# Altium project ImprovedBlackPillF411.PrjPcb
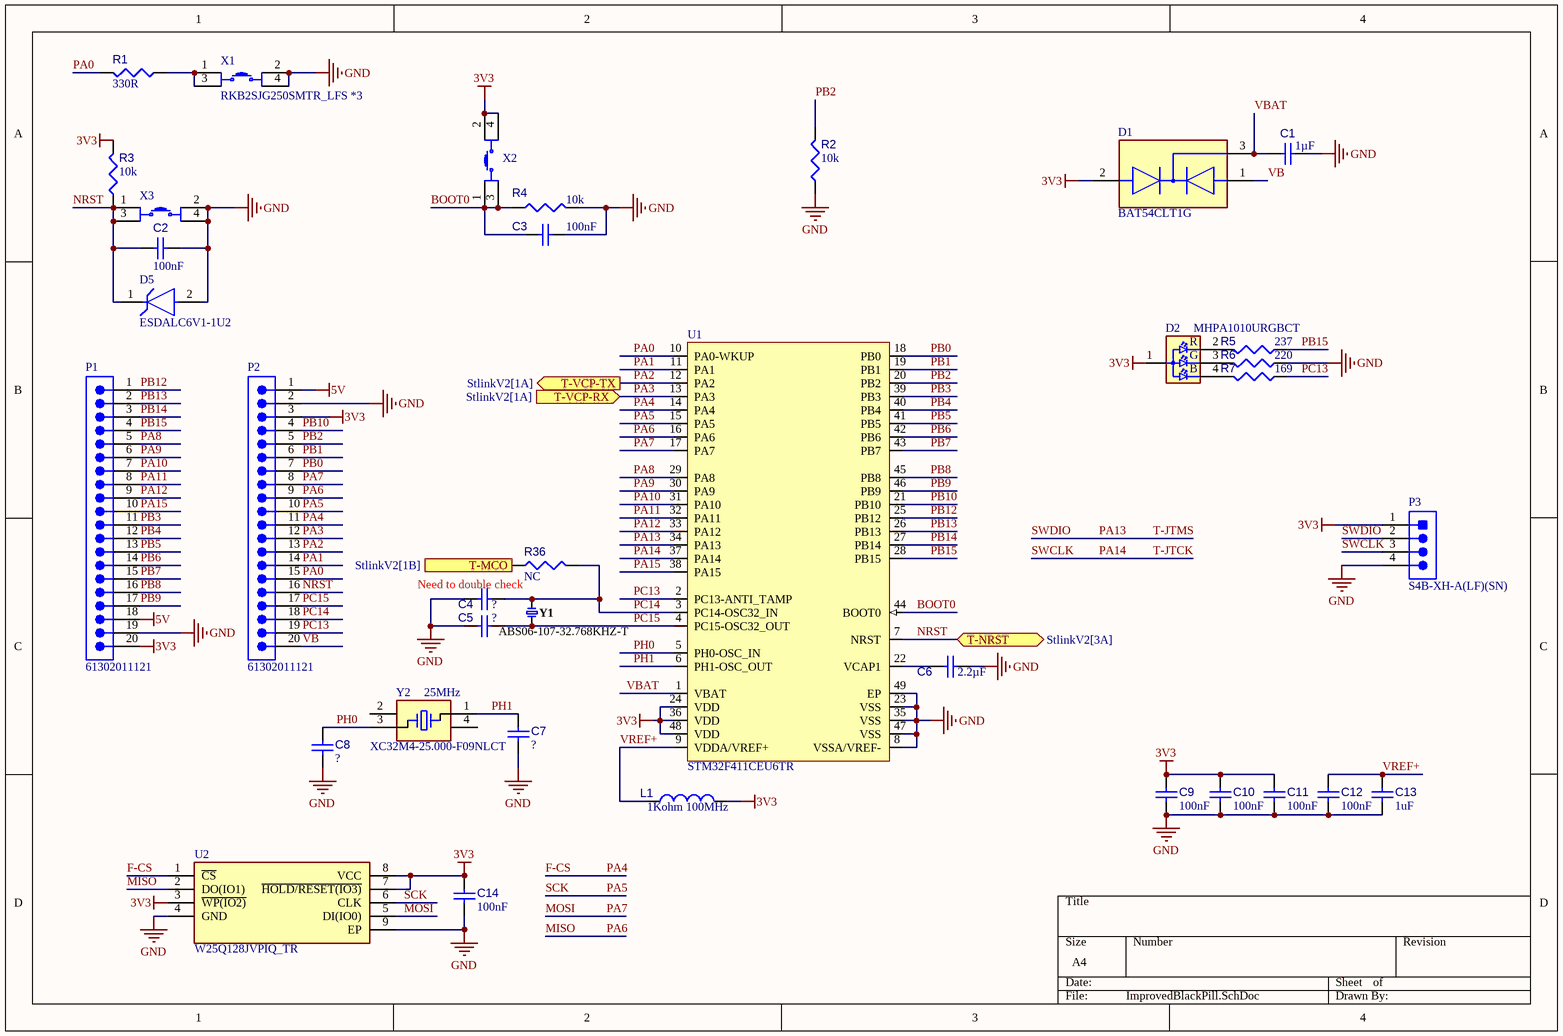
[diagram p0: ImprovedBlackPill.SchDoc]
3 sheets, 107 parts. Net scope: flat (ports and power ports of the same name join across sheets).
Sheets:
  ImprovedBlackPill.SchDoc
  StlinkV2.SchDoc
  Power.SchDoc

## Sheet ImprovedBlackPill.SchDoc
size A4; SheetNumber: 1; SheetTotal: 3

### Parts
C1  value 1µF  [CAPC1005X55X25ML05T10]  (hidden comment: Capacitor 1 uF +/- 10% 6.3 V 0402)
C2  value 100nF  [CAPC1005X55X25ML05T05]  (hidden comment: Capacitor 10 pF +/- 5% 50 V 0402)
C3  value 100nF  [CAPC1005X55X25ML05T05]  (hidden comment: Capacitor 10 pF +/- 5% 50 V 0402)
C4  Capacitor 10 pF +/- 5% 50 V 0402  [CAPC1005X55X25ML05T05]  (value not drawn)
C5  Capacitor 10 pF +/- 5% 50 V 0402  [CAPC1005X55X25ML05T05]  (value not drawn)
C6  value 2.2µF  [CAPC2013X135X45NL10T25]  (hidden comment: Capacitor 1 uF +/- 10% 50 V 0805)
C7  Capacitor 10 pF +/- 5% 50 V 0402  [CAPC1005X55X25ML05T05]  (value not drawn)
C8  Capacitor 10 pF +/- 5% 50 V 0402  [CAPC1005X55X25ML05T05]  (value not drawn)
C9  value 100nF  [CAPC1005X55X25ML05T05]  (hidden comment: Capacitor 10 pF +/- 5% 50 V 0402)
C10  value 100nF  [CAPC1005X55X25ML05T05]  (hidden comment: Capacitor 10 pF +/- 5% 50 V 0402)
C11  value 100nF  [CAPC1005X55X25ML05T05]  (hidden comment: Capacitor 10 pF +/- 5% 50 V 0402)
C12  value 100nF  [CAPC1005X55X25ML05T05]  (hidden comment: Capacitor 10 pF +/- 5% 50 V 0402)
C13  value 1uF  [CAPC1005X55X25ML05T05]  (hidden comment: Capacitor 10 pF +/- 5% 50 V 0402)
C14  value 100nF  [CAPC1005X55X25ML05T05]  (hidden comment: Capacitor 10 pF +/- 5% 50 V 0402)
D1  BAT54CLT1G  [FP-318-08-IPC_C]
D2  MHPA1010URGBCT  [FP-SML-LX0404SIUPGUSB-MFG]
D5  ESDALC6V1-1U2  [FP-ST0201-MFG]
L1  value 1Kohm 100MHz  [MURA-LQP15MN3N6B02D-2_N]  (hidden comment: LQP15MN3N6B02D)
P1  61302011121  [61302011121]
P2  61302011121  [61302011121]
P3  S4B-XH-A(LF)(SN)  [JST-S4B-XH-A(LF)(SN)_V]
R1  value 330R  [RESC1005X40X25ML10T10]  (hidden comment: Resistor 15k +/-1% 0402 63 mW)
R2  value 10k  [RESC1005X40X25ML10T10]  (hidden comment: Resistor 15k +/-1% 0402 63 mW)
R3  value 10k  [RESC1005X40X25ML10T10]  (hidden comment: Resistor 15k +/-1% 0402 63 mW)
R4  value 10k  [RESC1005X40X25ML10T10]  (hidden comment: Resistor 15k +/-1% 0402 63 mW)
R5  value 237  [RESC1005X40X25ML10T10]  (hidden comment: Resistor 15k +/-1% 0402 63 mW)
R6  value 220  [RESC1005X40X25ML10T10]  (hidden comment: Resistor 15k +/-1% 0402 63 mW)
R7  value 169  [RESC1005X40X25ML10T10]  (hidden comment: Resistor 15k +/-1% 0402 63 mW)
R36  value NC  [RESC0402(1005)_L]  (hidden comment: Jumper 0402)
U1  STM32F411CEU6TR  [STM-UFQFPN48_N]
U2  W25Q128JVPIQ_TR  [SON127P600X500X80-9N-D]
X1  RKB2SJG250SMTR_LFS *3  [RKB2SJG250SMTRLFS]
X2  RKB2SJG250SMTR_LFS  [RKB2SJG250SMTRLFS]  (value not drawn)
X3  RKB2SJG250SMTR_LFS  [RKB2SJG250SMTRLFS]  (value not drawn)
Y1  ABS06-107-32.768KHZ-T  [FP-ABS06-MFG]
Y2  XC32M4-25.000-F09NLCT  [830105863709]

### Ports
T-MCO (out, see StlinkV2[1B]), T-NRST (bidir, see StlinkV2[3A]), T-VCP-RX (in, see StlinkV2[1A]), T-VCP-TX (out, see StlinkV2[1A])

### Nets
3V3: C9.2 C10.2 C11.2 C14.2 D1.2(2_ANODE) D2.1(Common_Anode) L1.1 P1.20 P2.3 P3.1 R3.2 U1.24(VDD) U1.36(VDD) U1.48(VDD) U2.3(~{WP}~{(IO2)}) U2.7(~{HOLD/RESET(IO3)}) U2.8(VCC) X2.2(COM_2) X2.4(NO_2)
5V: P1.18 P2.1
GND: C1.2 C2.2 C3.2 C4.1 C5.1 C6.2 C7.1 C8.1 C9.1 C10.1 C11.1 C12.1 C13.1 C14.1 D5.2(A) P1.19 P2.2 P3.4 R2.1 R4.2 R6.1 U1.8(VSSA/VREF-) U1.23(VSS) U1.35(VSS) U1.47(VSS) U1.49(EP) U2.4(GND) U2.9(EP) X1.2(COM_2) X1.4(NO_2) X3.2(COM_2) X3.4(NO_2)
BOOT0: C3.1 R4.1 U1.44(BOOT0) X2.1(COM_1) X2.3(NO_1)
F-CS: P2.11 U1.14(PA4) U2.1(~{CS})  [also labelled PA4]
MISO: P2.9 U1.16(PA6) U2.2(DO(IO1))  [also labelled PA6]
MOSI: P2.8 U1.17(PA7) U2.5(DI(IO0))  [also labelled PA7]
NRST: C2.1 D5.1(C) P2.16 R3.1 U1.7(NRST) X3.1(COM_1) X3.3(NO_1) ; port T-NRST
PA0: P2.15 R1.2 U1.10(PA0-WKUP)
PA1: P2.14 U1.11(PA1)
PA2: P2.13 U1.12(PA2) ; port T-VCP-TX
PA3: P2.12 U1.13(PA3) ; port T-VCP-RX
PA5: P2.10 U1.15(PA5) U2.6(CLK)  [also labelled SCK]
PA8: P1.5 U1.29(PA8)
PA9: P1.6 U1.30(PA9)
PA10: P1.7 U1.31(PA10)
PA11: P1.8 U1.32(PA11)
PA12: P1.9 U1.33(PA12)
PA13: P3.2 U1.34(PA13)  [also labelled SWDIO, T-JTMS]
PA14: P3.3 U1.37(PA14)  [also labelled SWCLK, T-JTCK]
PA15: P1.10 U1.38(PA15)
PB0: P2.7 U1.18(PB0)
PB1: P2.6 U1.19(PB1)
PB2: P2.5 R2.2 U1.20(PB2)
PB3: P1.11 U1.39(PB3)
PB4: P1.12 U1.40(PB4)
PB5: P1.13 U1.41(PB5)
PB6: P1.14 U1.42(PB6)
PB7: P1.15 U1.43(PB7)
PB8: P1.16 U1.45(PB8)
PB9: P1.17 U1.46(PB9)
PB10: P2.4 U1.21(PB10)
PB12: P1.1 U1.25(PB12)
PB13: P1.2 U1.26(PB13)
PB14: P1.3 U1.27(PB14)
PB15: P1.4 R5.1 U1.28(PB15)
PC13: P2.19 R7.1 U1.2(PC13-ANTI_TAMP)
PC14: C4.2 P2.18 R36.2 U1.3(PC14-OSC32_IN) Y1.2
PC15: C5.2 P2.17 U1.4(PC15-OSC32_OUT) Y1.1
PH0: C8.2 U1.5(PH0-OSC_IN) Y2.3(CRYSTAL__2)
PH1: C7.2 U1.6(PH1-OSC_OUT) Y2.1(CRYSTAL__1)
VB: D1.1(1_ANODE) P2.20
VBAT: C1.1 D1.3(C) U1.1(VBAT)
VREF+: C12.2 C13.2 L1.2 U1.9(VDDA/VREF+)
NetC6_1: C6.1 U1.22(VCAP1)
NetD2_2: D2.2(Red_C) R5.2
NetD2_3: D2.3(Blue_C) R6.2
NetD2_4: D2.4(B) R7.2
NetR1_1: R1.1 X1.1(COM_1) X1.3(NO_1)
NetR11_2: R36.1 ; port T-MCO

Not connected (* = marked no-connect by the designer): Y2 2(GND_&_LID_1) 4(GND_&_LID_2)

### Notes on the sheet
- Need to double check
- (near Y2) 25MHz
- (in symbol CMP-007-00037-2) R; G

### Library data of the parts
C1 = CMP-001-00008-7: Chip Capacitor, 1 uF, +/- 10%, 6.3 V, 0402 (1005 Metric); Capacitor Type: Ceramic; Voltage Rating: 6.3V; Max Operating Temperature: 85°C; Mounting Technology: SM; Tolerance: 10%; Case/Package: 0402; RoHS Compliant: True; Min Operating Temperature: -55°C; Pins: 2
C2 C4 C5 C9 = CMP-001-00013-7: Chip Capacitor, 10 pF, +/- 5%, 50 V, 0402 (1005 Metric); Capacitor Type: Ceramic; Voltage Rating: 50V; Max Operating Temperature: 125°C; Pins: 2; Mounting Technology: SM; Tolerance: 5%; RoHS Compliant: True; Case/Package: 0402; Min Operating Temperature: -55°C
  C4 C5: Value: ?
C3 C7 C8 C10-C14 = CMP-001-00013-6: Chip Capacitor, 10 pF, +/- 5%, 50 V, 0402 (1005 Metric); Capacitor Type: Ceramic; Voltage Rating: 50V; Max Operating Temperature: 125°C; Pins: 2; Mounting Technology: SM; Tolerance: 5%; RoHS Compliant: True; Case/Package: 0402; Min Operating Temperature: -55°C
  C7 C8: Value: ?
C6 = CMP-001-00007-6: Chip Capacitor, 1 uF, +/- 10%, 50 V, 0805 (2012 Metric); Capacitor Type: Ceramic; Voltage Rating: 50V; Min Operating Temperature: -55°C; RoHS Compliant: True; Mounting Technology: SM; Case/Package: 0805; Max Operating Temperature: 125°C; Tolerance: 10%; Pins: 2
D1 = CMP-00000-1: Rectifier Diode, Schottky, 2 Element, 0.1A, 30V V(RRM), Silicon, TO-236; Reverse Recovery Time-Max: 0.005us; Max Power Dissipation: 225mW; Max Output current: 100mA; Non-rep Pk Forward Current-Max: 600mA; Qualification Status: Not Qualified; Package Body Material: Plastic; Forward Voltage: 240mV; Time @ Peak Reflow Temperature-Max (s): 40s; Number of Elements: 2; Terminal Finish: Tin; Diode Element Material: SILICON; JESD-609 Code: e3; Peak Reflow Temperature (Cel): 260°C; JEDEC-95 Code: TO-236; Technology: SCHOTTKY; Surface Mount: Yes; Package Shape: Rectangular; RoHS Compliant: Yes; Pins: 3; Moisture Sensitivity Level: 1; Max Operating Temperature: 125°C; Diode Type: RECTIFIER; Terminal Position: DUAL; Terminal Form: Gull Wing; Reach SVHC Compliant: Yes; Package Style: SMALL OUTLINEMeter; JESD-30 Code: R-PDSO-G3; Rep Pk Reverse Voltage-Max: 30V; Min Operating Temperature: -55°C
D2 = CMP-007-00037-2
D5 = CMP-004-00076-1: Trans Voltage Suppressor Diode, 20W, Unidirectional, 1 Element, Silicon; Max Operating Temperature: 125°C; Pins: 2; RoHS Compliant: Yes
L1 = CMP-006-00010-6: Inductor, 500 MHz, 170 mA, 0.5 Ohm, -40 to 85 degC, 01005 (0402 Metric), RoHS, Tape and Reel; Manufacturer: Murata; Core Material: Ferrite; Self Resonant Frequency: 6GHz; Current Rating: 170mA; Shielding: Unshielded; Q Factor: 13; Datasheet URL: http://download.siliconexpert.com/pdfs/2016/4/21/8/25/31/646/mrt_/manual/797549851250188lqp15mn3n6b0223.pdf; Datasheet Version: Apr-16; Case/Package: 0402; Mounting Technology: SM; Min Operating Temperature: -40°C; RoHS Compliant: True; Package Description: 2-Pin Surface Mount Device, Body 1 x 0.5 mm; Max Operating Temperature: 85°C; Package Quantity: 10000; Package Reference: 0402; Packaging: TapeandReel
P1 P2 = CMP-002-00071-1: Board Connector, 20 Contact(s), 1 Row(s), Male, Straight, 0.1 inch Pitch, Solder Terminal, Locking, Black Insulator, Plug; RoHS Compliant: Yes; Min Operating Temperature: -40°C; Mounting Technology: Board; Connector Type: BOARD CONNECTOR; Max Operating Temperature: 125°C
P3 = CMP-002-00034-2: Male Header, Pitch 2.5 mm, 1 x 4 Position, Height 6.1 mm, Tail Length 3.4 mm, -25 to 85 degC, RoHS, Bulk; Manufacturer: JST; Manufacturer URL: http://www.jst.com/home2.html; RoHS Compliant: Unknown; Gender: Male; Min Operating Temperature: -25°C; Datasheet URL: http://www.jst-mfg.com/product/pdf/eng/eXH.pdf; Case/Package: S4B-XH-A(LF)(SN); Datasheet Version: May-16; Mounting Technology: TH; Package Reference: S4B-XH-A(LF)(SN); Max Operating Temperature: 85°C; Package Description: XH Series Disconnectable Crimp Style Connector, Pitch 2.5 mm, 1 x 4 Position, Height 6.1 mm, Tail Length 3.4 mm; Connector Type: Header
R1-R7 = CMP-009-00026-5: Chip Resistor, 15 KOhm, +/- 1%, 0.063 W, -55 to 155 degC, 0402 (1005 Metric); Power: 63mW; Min Operating Temperature: -55°C; Tolerance: 1%; Max Operating Temperature: 155°C; Mounting Technology: SM; Case/Package: 0402; RoHS Compliant: True; Pins: 2
R36 = CMP-009-00148-3: Pins: 2; Max Operating Temperature: 155°C; Min Operating Temperature: -55°C; Case/Package: 0402
U1 = CMP-020-00023-2: RISC Microcontroller, 32-Bit, FLASH, CORTEX-M4 CPU, 100MHz, CMOS; Nominal Supply Voltage: 3.3V; Max Supply Voltage: 3.6V; Min Supply Voltage: 1.7V; RoHS Compliant: Yes; Max Operating Temperature: 85°C; Case/Package: HVQCCN; Min Operating Temperature: -40°C; Pins: 48
U2 = CMP-037-000000-3: NOR Flash spiFlash, 3V, 128M-bit, 4Kb Uniform Sector; Manufacturer_Part_Number: W25Q128JVPIQ TR; Manufacturer_Name: Winbond; Geometry.Height: 0.8mm; Source: W25Q128JVPIQ_TR.SchLib; Mouser Part Number: 454-W25Q128JVPIQTR; Design Item ID: W25Q128JVPIQ_TR; Datasheet Link: https://www.winbond.com/resource-files/w25q128jv%20revf%2003272018%20plus.pdf; Mouser Price/Stock: https://www.mouser.co.uk/ProductDetail/Winbond/W25Q128JVPIQ-TR?qs=qSfuJ%252Bfl%2Fd6H7vbXyrDu3w%3D%3D
X1-X3 = CMP-008-000000-3: Tactile Switches J Bend SMT Term 400gf Force; Manufacturer_Part_Number: RKB2SJG250SMTR LFS; Manufacturer_Name: C & K COMPONENTS; Geometry.Height: 2.7mm; Mouser Part Number: 611-RKB2SJG250SMTRLF; Datasheet Link: https://www.ckswitches.com/media/3130/ck_rk_datasheet.pdf; Mouser Price/Stock: https://www.mouser.co.uk/ProductDetail/CK/RKB2SJG250SMTR-LFS?qs=iLbezkQI%252Bsgsc0TY%2FPaT8A%3D%3D; Source: RKB2SJG250SMTR_LFS.SchLib; Design Item ID: RKB2SJG250SMTR_LFS
Y1 = CMP-003-00037-1: Parallel - Fundamental Quartz Crystal, 0.032768MHz Nom; Load Capacitance: 4pF; ESR: 80k; Mounting Technology: Surface Mount; Min Operating Temperature: -40°C; Max Operating Temperature: 85°C; RoHS Compliant: Yes
Y2 = CMP-003-000311-1: XC32M4-25.000-F09NLCT Cload 9pF; Frequency: 25MHz; Load Capacitance: 9pF; Case/Package: 3.2 x 2.5mm

## Sheet StlinkV2.SchDoc
size A4; SheetNumber: 2; SheetTotal: 3
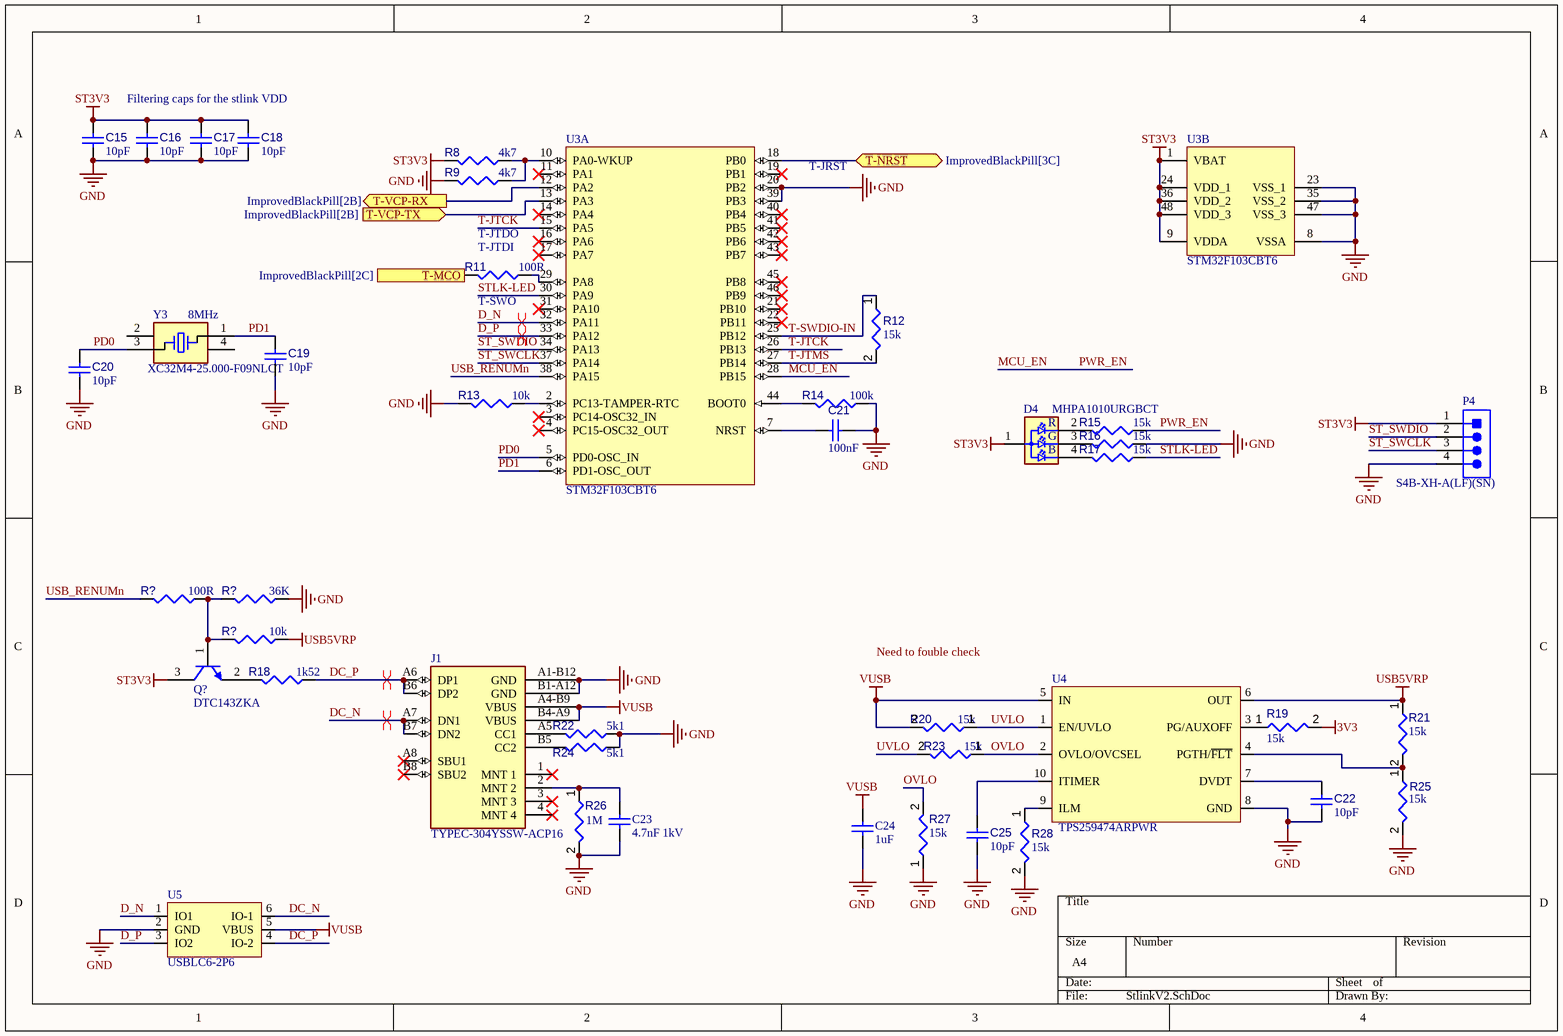
[diagram p1: StlinkV2.SchDoc]

### Parts
(Parts that share a designator on the sheet are numbered #1, #2 ... from top to bottom, then left to right.)
C15  value 10pF  [CAPC1005X55X25ML05T05]  (hidden comment: Capacitor 10 pF +/- 5% 50 V 0402)
C16  value 10pF  [CAPC1005X55X25ML05T05]  (hidden comment: Capacitor 10 pF +/- 5% 50 V 0402)
C17  value 10pF  [CAPC1005X55X25ML05T05]  (hidden comment: Capacitor 10 pF +/- 5% 50 V 0402)
C18  value 10pF  [CAPC1005X55X25ML05T05]  (hidden comment: Capacitor 10 pF +/- 5% 50 V 0402)
C19  value 10pF  [CAPC1005X55X25ML05T05]  (hidden comment: Capacitor 10 pF +/- 5% 50 V 0402)
C20  value 10pF  [CAPC1005X55X25ML05T05]  (hidden comment: Capacitor 10 pF +/- 5% 50 V 0402)
C21  value 100nF  [CAPC1005X55X25ML05T05]  (hidden comment: Capacitor 10 pF +/- 5% 50 V 0402)
C22  value 10pF  [CAPC1005X55X25ML05T05]  (hidden comment: Capacitor 10 pF +/- 5% 50 V 0402)
C23  4.7nF 1kV  [CAPC2013X135X50ML15T20]
C24  1uF  [CAPC2013X135X50ML15T20]
C25  value 10pF  [CAPC1005X55X25ML05T05]  (hidden comment: Capacitor 10 pF +/- 5% 50 V 0402)
D4  MHPA1010URGBCT  [FP-SML-LX0404SIUPGUSB-MFG]
J1  TYPEC-304YSSW-ACP16  [FP-USB4110-GF-A-MFG]
P4  S4B-XH-A(LF)(SN)  [JST-S4B-XH-A(LF)(SN)_V]
Q?  DTC143ZKA  [ONSC-SOT-23-3-318-08_V]
R8  value 4k7  [RESC1005X40X25ML10T10]  (hidden comment: Resistor 15k +/-1% 0402 63 mW)
R9  value 4k7  [RESC1005X40X25ML10T10]  (hidden comment: Resistor 15k +/-1% 0402 63 mW)
R11  value 100R  [RESC1005X40X25ML10T10]  (hidden comment: Resistor 15k +/-1% 0402 63 mW)
R12  value 15k  [RESC1005X40X25ML10T10]  (hidden comment: Resistor 15k +/-1% 0402 63 mW)
R13  value 10k  [RESC1005X40X25ML10T10]  (hidden comment: Resistor 15k +/-1% 0402 63 mW)
R14  value 100k  [RESC1005X40X25ML10T10]  (hidden comment: Resistor 15k +/-1% 0402 63 mW)
R15  value 15k  [RESC1005X40X25ML10T10]  (hidden comment: Resistor 15k +/-1% 0402 63 mW)
R16  value 15k  [RESC1005X40X25ML10T10]  (hidden comment: Resistor 15k +/-1% 0402 63 mW)
R17  value 15k  [RESC1005X40X25ML10T10]  (hidden comment: Resistor 15k +/-1% 0402 63 mW)
R18  value 1k52  [RESC1005X40X25ML10T10]  (hidden comment: Resistor 15k +/-1% 0402 63 mW)
R19  value 15k  [RESC1005X40X25ML10T10]  (hidden comment: Resistor 15k +/-1% 0402 63 mW)
R20  value 15k  [RESC1005X40X25ML10T10]  (hidden comment: Resistor 15k +/-1% 0402 63 mW)
R21  value 15k  [RESC1005X40X25ML10T10]  (hidden comment: Resistor 15k +/-1% 0402 63 mW)
R22  value 5k1  [RESC1005X40X25ML10T10]  (hidden comment: Resistor 15k +/-1% 0402 63 mW)
R23  value 15k  [RESC1005X40X25ML10T10]  (hidden comment: Resistor 15k +/-1% 0402 63 mW)
R24  value 5k1  [RESC1005X40X25ML10T10]  (hidden comment: Resistor 15k +/-1% 0402 63 mW)
R25  value 15k  [RESC1005X40X25ML10T10]  (hidden comment: Resistor 15k +/-1% 0402 63 mW)
R26  value 1M  [RESC1005X40X25ML10T10]  (hidden comment: Resistor 15k +/-1% 0402 63 mW)
R27  value 15k  [RESC1005X40X25ML10T10]  (hidden comment: Resistor 15k +/-1% 0402 63 mW)
R28  value 15k  [RESC1005X40X25ML10T10]  (hidden comment: Resistor 15k +/-1% 0402 63 mW)
R?#1  value 100R  [RESC1005X40X25ML10T10]  (hidden comment: Resistor 15k +/-1% 0402 63 mW)
R?#2  value 36K  [RESC1005X40X25ML10T10]  (hidden comment: Resistor 15k +/-1% 0402 63 mW)
R?#3  value 10k  [RESC1005X40X25ML10T10]  (hidden comment: Resistor 15k +/-1% 0402 63 mW)
U3  STM32F103CBT6  [STM-LQFP48_M]  (parts A,B of 2)
U4  TPS259474ARPWR  [VQFN-HR-10]
U5  USBLC6-2P6  [FP-SOT-666-MFG]
Y3  XC32M4-25.000-F09NLCT  [830105863709]

### Ports
T-MCO (out, see ImprovedBlackPill[2C]), T-NRST (bidir, see ImprovedBlackPill[3C]), T-VCP-RX (out, see ImprovedBlackPill[2B]), T-VCP-TX (in, see ImprovedBlackPill[2B])

### Nets
3V3: R19.2
GND: C15.1 C16.1 C17.1 C18.1 C19.1 C20.1 C21.1 C22.1 C23.2 C24.2 C25.1 J1.A1-B12(GND) J1.B1-A12(GND) P4.4 R9.2 R13.2 R14.1 R16.1 R22.1 R24.1 R25.2 R26.2 R27.1 R28.2 R?#2.1 U3.8(VSSA) U3.20(PB2) U3.23(VSS_1) U3.35(VSS_2) U3.39(PB3) U3.47(VSS_3) U4.8(GND) U5.2(GND)
ST3V3: C15.2 C16.2 C17.2 C18.2 D4.1(Common_Anode) P4.1 Q?.3(C) R8.2 U3.1(VBAT) U3.9(VDDA) U3.24(VDD_1) U3.36(VDD_2) U3.48(VDD_3)
USB5VRP: R21.1 R?#3.1 U4.6(OUT)
VUSB: C24.1 J1.A4-B9(VBUS) J1.B4-A9(VBUS) R20.2 U4.5(IN) U5.5(VBUS)
D_N: U3.32(PA11) U5.1(IO1)
D_P: U3.33(PA12) U5.3(IO2)
DC_N: J1.A7(DN1) J1.B7(DN2) U5.6(IO-1)
DC_P: J1.A6(DP1) J1.B6(DP2) R18.1 U5.4(IO-2)
MCU_EN: R15.1 U3.28(PB15)  [also labelled PWR_EN]
NRST: U3.18(PB0) ; port T-NRST
OVLO: R23.1 R27.2 U4.2(OVLO/OVCSEL)
PA2: U3.13(PA3) ; port T-VCP-TX
PA3: U3.12(PA2) ; port T-VCP-RX
PD0: C20.2 U3.5(PD0-OSC_IN) Y3.3(CRYSTAL__2)
PD1: C19.2 U3.6(PD1-OSC_OUT) Y3.1(CRYSTAL__1)
ST_SWCLK: P4.3 U3.37(PA14)
ST_SWDIO: P4.2 U3.34(PA13)
STLK-LED: R17.1 U3.30(PA9)
T-JTCK: U3.15(PA5) U3.26(PB13)
T-JTMS: R12.2 U3.27(PB14)
T-SWDIO-IN: R12.1 U3.25(PB12)
USB_RENUMn: R?#1.2 U3.38(PA15)
UVLO: R20.1 R23.2 U4.1(EN/UVLO)
NetC21_2: C21.2 U3.7(NRST)
NetC22_2: C22.2 U4.7(DVDT)
NetC23_1: C23.1 J1.2(MNT_2) R26.1
NetC25_2: C25.2 U4.10(ITIMER)
NetD4_2: D4.2(Red_C) R15.2
NetD4_3: D4.3(Blue_C) R16.2
NetD4_4: D4.4(B) R17.2
NetJ1_A5: J1.A5(CC1) R22.2
NetJ1_B5: J1.B5(CC2) R24.2
NetQ?_1: Q?.1(B) R?#1.1 R?#2.2 R?#3.2
NetQ?_2: Q?.2(E) R18.2
NetR8_1: R8.1 R9.1 U3.10(PA0-WKUP)
NetR11_1: R11.1 U3.29(PA8)
NetR11_2: R11.2 ; port T-MCO
NetR13_1: R13.1 U3.2(PC13-TAMPER-RTC)
NetR14_2: R14.2 U3.44(BOOT0)
NetR19_1: R19.1 U4.3(PG/AUXOFF)
NetR21_2: R21.2 R25.1 U4.4(PGTH/~{FLT})
NetR28_1: R28.1 U4.9(ILM)

Not connected (* = marked no-connect by the designer): J1 1(MNT_1)* 3(MNT_3)* 4(MNT_4)* A8(SBU1)* B8(SBU2)*; U3 3(PC14-OSC32_IN)* 4(PC15-OSC32_OUT)* 11(PA1)* 14(PA4)* 16(PA6)* 17(PA7)* 19(PB1)* 21(PB10)* 22(PB11)* 31(PA10)* 40(PB4)* 41(PB5)* 42(PB6)* 43(PB7)* 45(PB8)* 46(PB9)*; Y3 2(GND_&_LID_1) 4(GND_&_LID_2)

### Layout directives
differential pair: D_N, D_P, DC_N, DC_P

### Notes on the sheet
- Filtering caps for the stlink VDD
- T-JRST
- (near R11) T-JTDI
- T-JTDO
- (near R11) T-SWO
- (near Y3) 8MHz
- Labels drawn without touching a wire or pin: Need to fouble check
- (in symbol CMP-007-00037-2) R; G

### Library data of the parts
C15-C22 C25 = CMP-001-00013-7: as C2 on sheet ImprovedBlackPill; Max Operating Temperature: 125°C; Pins: 2; Mounting Technology: SM; Tolerance: 5%; RoHS Compliant: True; Case/Package: 0402; Min Operating Temperature: -55°C
C23 C24 = CMP-2265601-2: CAP CER 10000PF 50V 10% X7R 0805; Manufacturer Part Number: VJ0805Y103KXACW1BC; Capacitance: 1e-08 F; Case/Package (SI): 2012; Dielectric Material: Tantalum; Lead-Free Status: Lead Free; Voltage Rating (DC): 50.0 V; Capacitance Tolerance: ±10%; Case/Package: 0805; Dielectric Characteristic: X7R; Mounting Style: Surface Mount; Number of Pins: 2; Octopart Url: https://octopart.com/vj0805y103kxacw1bc-vishay-39476146; OctopartID: 26e2edb25836f925; Packaging: Tape; RoHS: Compliant; Size-Height: 0.000925 m; Size-Length: 0.002 m; Size-Width: 0.00125 m
D4 = CMP-007-00037-2
J1 = CMP-002-00169-4: 5A USB 3.1 1 260℃ Horizontal attachment 16P Female -25℃~+85℃ Type-C SMD USB Connectors ROHS
P4 = CMP-002-00034-2: as P3 on sheet ImprovedBlackPill; Manufacturer URL: http://www.jst.com/home2.html; RoHS Compliant: Unknown; Gender: Male; Min Operating Temperature: -25°C; Datasheet URL: http://www.jst-mfg.com/product/pdf/eng/eXH.pdf; Case/Package: S4B-XH-A(LF)(SN); Datasheet Version: May-16; Mounting Technology: TH; Package Reference: S4B-XH-A(LF)(SN); Max Operating Temperature: 85°C; Package Description: XH Series Disconnectable Crimp Style Connector, Pitch 2.5 mm, 1 x 4 Position, Height 6.1 mm, Tail Length 3.4 mm; Connector Type: Header
Q? = CMP-013-00007-3: General Purpose Transistor, NPN Silicon, 40 V, 0.2 A, -55 to 150 degC, 3-Pin SOT23, RoHS, Tape and Reel; Manufacturer: ON Semiconductor; Elements: 1; Power: 225mW; Frequency: 300MHz; hFE Min: 80; Vce Max: 300mV; Mounting Technology: SM; Min Operating Temperature: -55°C; Datasheet URL: http://www.onsemi.cn/pub_link/Collateral/MMBT3904LT1-D.PDF; Pins: 3; Package Description: 3-Pin Small Outline Transistor, Body 2.9 x 1.3 mm, Pitch 0.95 mm; Max Operating Temperature: 150°C; Package Reference: SOT-23 (318-08); Package Quantity: 3000; RoHS Compliant: True; Packaging: TapeandReel; Datasheet Version: Rev. 12, 11/2012; Case/Package: TO-236-3
R8 R9 R11-R28 R?#1-R?#3 = CMP-009-00026-5: as R1 on sheet ImprovedBlackPill; Min Operating Temperature: -55°C; Tolerance: 1%; Max Operating Temperature: 155°C; Mounting Technology: SM; Case/Package: 0402; RoHS Compliant: True; Pins: 2
U3 = CMP-020-00024-1: RISC Microcontroller, 32-Bit, FLASH, CORTEX-M3 CPU, 72MHz, CMOS, PQFP48; Max Supply Voltage: 3.6V; Clock Frequency: 16MHz; Min Supply Voltage: 2V; Nominal Supply Voltage: 3.3V; Min Operating Temperature: -40°C; Case/Package: LFQFP; Max Operating Temperature: 105°C; RoHS Compliant: Yes; Pins: 48
U4 = CMP-030-000087-2: 2.7-V–23-V, 5.5-A, 28-mΩ True Reverse Current Blocking eFuse with / Input Reverse Polarity Protection; Manufacturer: Texas Instruments; Design Item ID: TPS259472ARPWR; Manufacturer Part Number: TPS259472ARPWR; Source: Schematic-Lib-PhilsLab.SchLib
U5 = CMP-004-00070-1: Trans Voltage Suppressor Diode, 5V V(RWM), Unidirectional, 1 Element, Silicon; Min Operating Temperature: -40°C; RoHS Compliant: Yes; Pins: 6; Max Operating Temperature: 125°C
Y3 = CMP-003-000311-1: Load Capacitance: 9pF; Frequency: 25MHz; Case/Package: 3.2 x 2.5mm

## Sheet Power.SchDoc
size A4; SheetNumber: 3; SheetTotal: 3
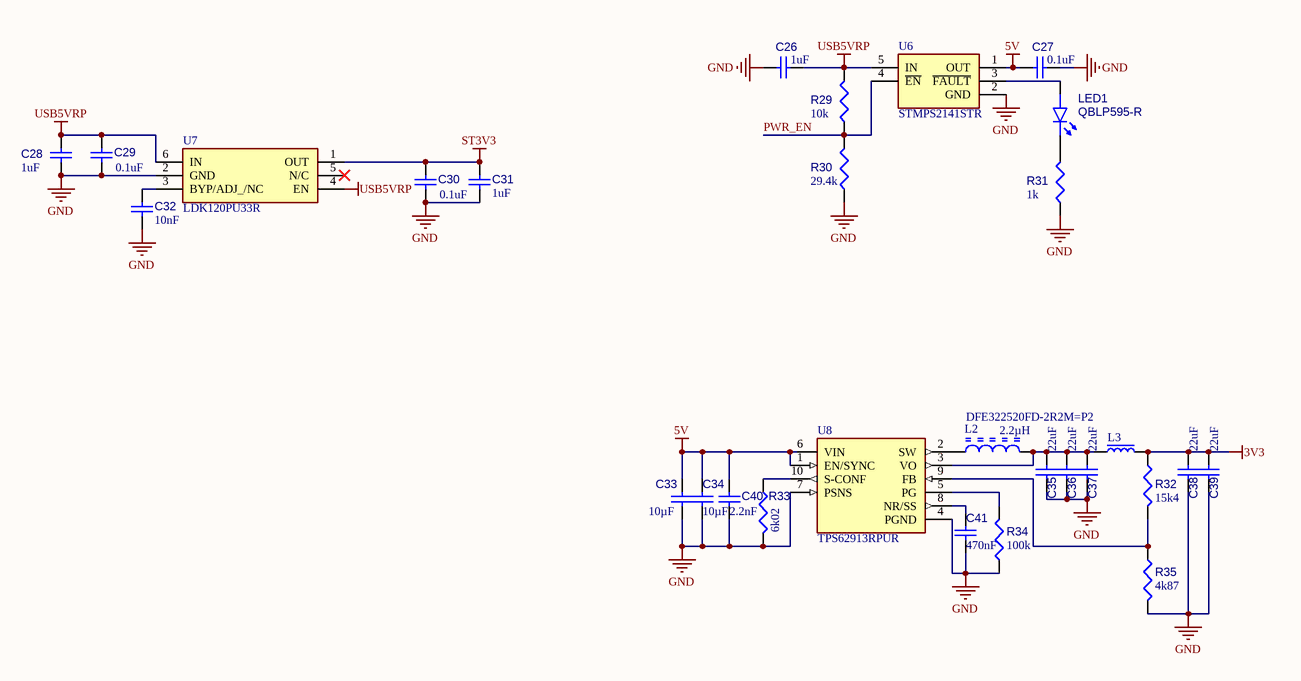
[diagram p2: Power.SchDoc]

### Parts
C26  value 1uF  [CAPC1005X55X25ML05T05]  (hidden comment: Capacitor 10 pF +/- 5% 50 V 0402)
C27  value 0.1uF  [CAPC1005X55X25ML05T05]  (hidden comment: Capacitor 10 pF +/- 5% 50 V 0402)
C28  value 1uF  [CAPC1005X55X25ML05T05]  (hidden comment: Capacitor 10 pF +/- 5% 50 V 0402)
C29  value 0.1uF  [CAPC1005X55X25ML05T05]  (hidden comment: Capacitor 10 pF +/- 5% 50 V 0402)
C30  value 0.1uF  [CAPC1005X55X25ML05T05]  (hidden comment: Capacitor 10 pF +/- 5% 50 V 0402)
C31  value 1uF  [CAPC1005X55X25ML05T05]  (hidden comment: Capacitor 10 pF +/- 5% 50 V 0402)
C32  value 10nF  [CAPC1005X55X25ML05T05]  (hidden comment: Capacitor 10 pF +/- 5% 50 V 0402)
C33  value 10µF  [CAPC2013X135X45NL10T25]  (hidden comment: Capacitor 1 uF +/- 10% 50 V 0805)
C34  value 10µF  [CAPC2013X135X45NL10T25]  (hidden comment: Capacitor 1 uF +/- 10% 50 V 0805)
C35  value 22uF  [CAPC3216X180X50ML20T25]  (hidden comment: Capacitor 10 uF +/- 10% 16 V 1206)
C36  value 22uF  [CAPC3216X180X50ML20T25]  (hidden comment: Capacitor 10 uF +/- 10% 16 V 1206)
C37  value 22uF  [CAPC3216X180X50ML20T25]  (hidden comment: Capacitor 10 uF +/- 10% 16 V 1206)
C38  value 22uF  [CAPC3216X180X50ML20T25]  (hidden comment: Capacitor 10 uF +/- 10% 16 V 1206)
C39  value 22uF  [CAPC3216X180X50ML20T25]  (hidden comment: Capacitor 10 uF +/- 10% 16 V 1206)
C40  value 2.2nF  [CAPC1005X55X25ML05T05]  (hidden comment: Capacitor 10 pF +/- 5% 50 V 0402)
C41  value 470nF  [CAPC1005X55X25ML05T05]  (hidden comment: Capacitor 10 pF +/- 5% 50 V 0402)
L2  DFE322520FD-2R2M=P2  Inductance: 2.2µH  [BOUR-CM322522_V]
L3  FB_0603  [FB_0603]  (value not drawn)
LED1  QBLP595-R  [QTB-QBLP595_V]
R29  value 10k  [RESC1005X40X25ML10T10]  (hidden comment: Resistor 15k +/-1% 0402 63 mW)
R30  value 29.4k  [RESC1005X40X25ML10T10]  (hidden comment: Resistor 15k +/-1% 0402 63 mW)
R31  value 1k  [RESC1005X40X25ML10T10]  (hidden comment: Resistor 15k +/-1% 0402 63 mW)
R32  value 15k4  [RESC1005X40X25ML10T10]  (hidden comment: Resistor 15k +/-1% 0402 63 mW)
R33  value 6k02  [RESC1005X40X25ML10T10]  (hidden comment: Resistor 15k +/-1% 0402 63 mW)
R34  value 100k  [RESC1005X40X25ML10T10]  (hidden comment: Resistor 15k +/-1% 0402 63 mW)
R35  value 4k87  [RESC1005X40X25ML10T10]  (hidden comment: Resistor 15k +/-1% 0402 63 mW)
U6  STMPS2141STR  [FP-SOT23-5L-IPC_C]
U7  LDK120PU33R  [LDK120PU33R]
U8  TPS62913RPUR  [FP-RPU0010A-MFG]

### Nets
3V3: C38.2 C39.2 L3.2 R32.1
5V: C27.1 C33.2 C34.2 C40.2 U6.1(OUT) U8.1(EN/SYNC) U8.6(VIN)
GND: C26.1 C27.2 C28.1 C29.1 C30.1 C31.2 C32.1 C33.1 C34.1 C35.1 C36.1 C37.1 C38.1 C39.1 C40.1 C41.1 R30.1 R31.1 R33.2 R34.2 R35.2 U6.2(GND) U7.2(GND) U8.4(PGND) U8.7(PSNS)
ST3V3: C30.2 C31.1 U7.1(OUT)
USB5VRP: C26.2 C28.2 C29.2 R29.2 U6.5(IN) U7.4(EN) U7.6(IN)
PWR_EN: R29.1 R30.2 U6.4(~{EN})
NetC32_2: C32.2 U7.3(BYP/ADJ_/NC)
NetC35_2: C35.2 C36.2 C37.2 L2.2 L3.1 U8.3(VO)
NetC41_2: C41.2 U8.8(NR/SS)
NetL2_1: L2.1 U8.2(SW)
NetLED1_1: LED1.1(K) R31.2
NetLED1_2: LED1.2(A) U6.3(~{FAULT})
NetR32_2: R32.2 R35.1 U8.9(FB)
NetR33_1: R33.1 U8.10(S-CONF)
NetR34_1: R34.1 U8.5(PG)

Not connected (* = marked no-connect by the designer): U7 5(N/C)*

### Library data of the parts
C26-C32 C40 C41 = CMP-001-00013-6: as C3 on sheet ImprovedBlackPill; Max Operating Temperature: 125°C; Pins: 2; Mounting Technology: SM; Tolerance: 5%; RoHS Compliant: True; Case/Package: 0402; Min Operating Temperature: -55°C
C33 C34 = CMP-001-00007-7: Chip Capacitor, 1 uF, +/- 10%, 50 V, 0805 (2012 Metric); Voltage Rating: 50V; Capacitor Type: Ceramic; RoHS Compliant: True; Case/Package: 0805; Tolerance: 10%; Min Operating Temperature: -55°C; Max Operating Temperature: 125°C; Pins: 2; Mounting Technology: SM
C35-C39 = CMP-001-00016-6: Chip Capacitor, 10 uF, +/- 10%, 16 V, 1206 (3216 Metric); Capacitor Type: Ceramic; Voltage Rating: 16V; Tolerance: 10%; Min Operating Temperature: -55°C; Pins: 2; Mounting Technology: SM; Case/Package: 1206; Max Operating Temperature: 125°C; RoHS Compliant: True
L2 = CMP-006-00005-3: Chip Inductor, 2.2 uH, +/- 10%, -40 to 125 degC, 1210 (3225 Metric), RoHS, Tape and Reel; Manufacturer: Bourns; Current Rating: 140mA; Q Factor: 30; Self Resonant Frequency: 30MHz; Core Material: Ferrite; Shielding: Unshielded; Resistance: 2.1Ohm; Mounting Technology: SM; Min Operating Temperature: -20°C; Datasheet URL: http://www.murata.com/~/media/webrenewal/support/library/catalog/products/emc/emifil/c30e.ashx?la=en-gb; Case/Package: 1210; Pins: 2; Package Description: 2-Pin Surface Mount Device, Body 3.2 x 2.5 mm; RoHS Compliant: True; Max Operating Temperature: 100°C; Inductance Tolerance: 10%; Package Reference: 1210; Packaging: TapeandReel; Package Quantity: 1; Datasheet Version: Aug-14; Tolerance: 10%
L3 = CMP-006-00022-1: Ferrite Bead SMD 0603 BLE18PS080SN1D Murata; Design Item ID: FB_0603; Source: Schematic-Lib-PhilsLab.SchLib; Manufacturer Part Number: *; LCSC: *; Distributor Link: *; Manufacturer: *
LED1 = CMP-007-00040-3: Chip LED 0402, Red, 0.02 A, 2.0 to 2.5 V, -40 to 80 degC, 2-Pin SMD, RoHS, Tape and Reel; Colour: Red; RoHS Compliant: Yes; Case/Package: 0402; Pins: 2; Mounting Technology: SMT
R29-R35 = CMP-009-00026-5: as R1 on sheet ImprovedBlackPill; Min Operating Temperature: -55°C; Tolerance: 1%; Max Operating Temperature: 155°C; Mounting Technology: SM; Case/Package: 0402; RoHS Compliant: True; Pins: 2
U6 = CMP-016-00010-4: Buffer/Inverter Based Peripheral Driver, 1 Driver, PDSO5; Min Supply Voltage: 2.7V; Max Supply Voltage: 5.5V; Nominal Supply Voltage: 5V; Min Operating Temperature: -40°C; Max Operating Temperature: 85°C; Case/Package: LSSOP; Pins: 5; RoHS Compliant: Yes
U7 = CMP-040-000000-3: STMicroelectronics LDK120PU33R, LDO Voltage Regulator, 200mA, 3.3 V +/-3%, 1.9  5.5 Vin, 6-Pin DFN; Geometry.Height: 0.5mm; Mouser Price/Stock: https://www.mouser.com/Search/Refine.aspx?Keyword=511-LDK120PU33R; Mouser Part Number: 511-LDK120PU33R; Manufacturer_Part_Number: LDK120PU33R; Source: LDK120PU33R.SchLib; Datasheet Link: https://componentsearchengine.com/Datasheets/1/LDK120PU33R.pdf; Design Item ID: LDK120PU33R; Manufacturer_Name: STMicroelectronics
U8 = CMP-019-00052-1: Switching Regulator, Current-mode, 2A, 2420kHz Switching Freq-Max; RoHS Compliant: Yes

## Nets that join several sheets
3V3: ImprovedBlackPill (19 pins), StlinkV2 (R19.2), Power (C38.2 C39.2 L3.2 R32.1)
5V: ImprovedBlackPill (P1.18 P2.1), Power (7 pins)
GND: ImprovedBlackPill (32 pins), StlinkV2 (33 pins), Power (25 pins)
ST3V3: StlinkV2 (13 pins), Power (C30.2 C31.1 U7.1)
USB5VRP: StlinkV2 (R21.1 R?#3.1 U4.6), Power (7 pins)
NetR11_2: ImprovedBlackPill (R36.1), StlinkV2 (R11.2)
NRST: ImprovedBlackPill (7 pins), StlinkV2 (U3.18)
PA2: ImprovedBlackPill (P2.13 U1.12), StlinkV2 (U3.13)
PA3: ImprovedBlackPill (P2.12 U1.13), StlinkV2 (U3.12)